# EAGLE design Osmofl2k_adapter_threechannel (EAGLE 7.5.0)
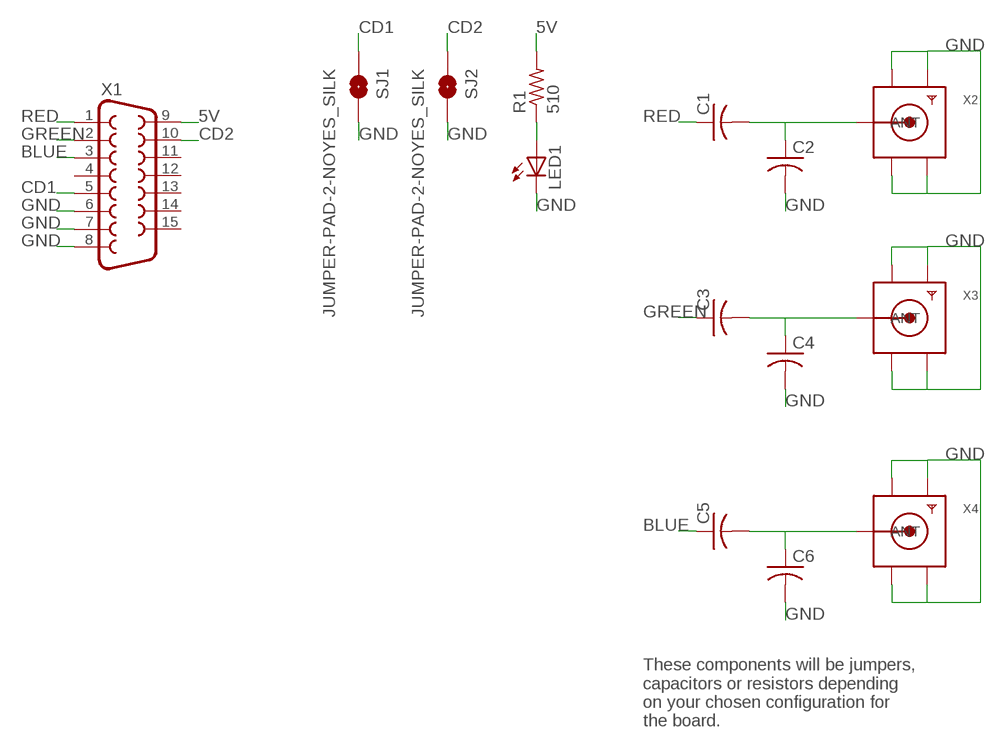
[diagram p0: schematic, sheet 1]

## Parts
C1  C-USC0603  [C0603]
C2  C-USC0603  [C0603]
C3  C-USC0603  [C0603]
C4  C-USC0603  [C0603]
C5  C-USC0603  [C0603]
C6  C-USC0603  [C0603]
LED1  LEDCHIPLED_0805  [CHIPLED_0805]
R1  510  R-US_R0805  [R0805]
SJ1  JUMPER-PAD-2-NOYES_SILK  [PAD-JUMPER-2-NO_YES_SILK]
SJ2  JUMPER-PAD-2-NOYES_SILK  [PAD-JUMPER-2-NO_YES_SILK]
X1  F15HDH  [HDF15H]
X2  SMACONNECTOR_EDGE  [SMA_EDGELAUNCH]
X3  SMACONNECTOR_EDGE  [SMA_EDGELAUNCH]
X4  SMACONNECTOR_EDGE  [SMA_EDGELAUNCH]

## Nets
5V: R1.2 X1.9
BLUE: C5.1 X1.3
CD1: SJ1.1 X1.5
CD2: SJ2.1 X1.10
GND: C2.2 C4.2 C6.2 LED1.C SJ1.2 SJ2.2 X1.6 X1.7 X1.8 X2.GND@1(GND4) X2.GND@2(GND3) X2.GND@3(GND2) X2.GND@4(GND1) X3.GND@1(GND4) X3.GND@2(GND3) X3.GND@3(GND2) X3.GND@4(GND1) X4.GND@1(GND4) X4.GND@2(GND3) X4.GND@3(GND2) X4.GND@4(GND1)
GREEN: C3.1 X1.2
N$1: C1.2 C2.1 X2.P(ANT)
N$2: LED1.A R1.1
N$3: C3.2 C4.1 X3.P(ANT)
N$4: C5.2 C6.1 X4.P(ANT)
RED: C1.1 X1.1
Unconnected: X1.4 X1.11 X1.12 X1.13 X1.14 X1.15

## Notes on the sheet
- These components will be jumpers,
  capacitors or resistors depending
  on your chosen configuration for
  the board.

## Library data of the parts
C1-C6 = adafruit:C-US: CAPACITOR, American symbol
LED1 = adafruit:LED: LED OSRAM: - CHIPLED LG R971, LG N971, LY N971, LG Q971, LY Q971, LO R971, LY R971 LH N974, LH R974 LS Q976, LO Q976, LY Q976 LO Q996 - Hyper CHIPLED LW Q18S LB Q993, LB Q99A, LB R99A - SideLED LS A670, LO A670, LY A670, LG A670, LP A670 LB A673, LV A673, LT A673, LW A673 LH A674 LY A675 LS A676, LA A676, LO A676, LY A676, LW A676 LS A679, LY A679, LG A679 - Hyper Micro SIDELED® LS Y876, LA Y876, LO Y876, LY Y876 LT Y87S - SmartLED LW L88C, LW L88S LB L89C, LB L89S, LG L890 LS L89K, LO L89K, LY L89K LS L896, LA L896, LO L896, LY L896 - TOPLED LS T670, LO T670, LY T670, LG T670, LP T670 LSG T670, LSP T670, LSY T670, LOP T670, LYG T670 LG T671, LOG T671, LSG T671 LB T673, LV T673, LT T673, LW T673 LH T674 LS T676, LA T676, LO T676, LY T676, LB T676, LH T676, LSB T676, LW T676 LB T67C, LV T67C, LT T67C, LS T67K, LO T67K, LY T67K, LW E67C LS E67B, LA E67B, LO E67B, LY E67B, LB E67C, LV E67C, LT E67C LW T67C LS T679, LY T679, LG T679 LS T770, LO T770, LY T770, LG T770, LP T770 LB T773, LV T773, LT T773, LW T773 LH T774 LS E675, LA E675, LY E675, LS T675 LS T776, LA T776, LO T776, LY T776, LB T776 LHGB T686 LT T68C, LB T68C - Hyper Mini TOPLED® LB M676 - Mini TOPLED Santana® LG M470 LS M47K, LO M47K, LY M47K Source: http://www.osram.convergy.de/
R1 = adafruit:R-US_: RESISTOR, American symbol
SJ1 SJ2 = SparkFun-Passives:JUMPER-PAD-2-NO
X1 = adafruit:F15: SUB-D HDH is also known as a 'right angle VGA' connector
X2-X4 = adafruit:SMACONNECTOR: SMA Connector 90° DIP SMA Connector, 50 Ohm (4UConnector: 07259)

## Board
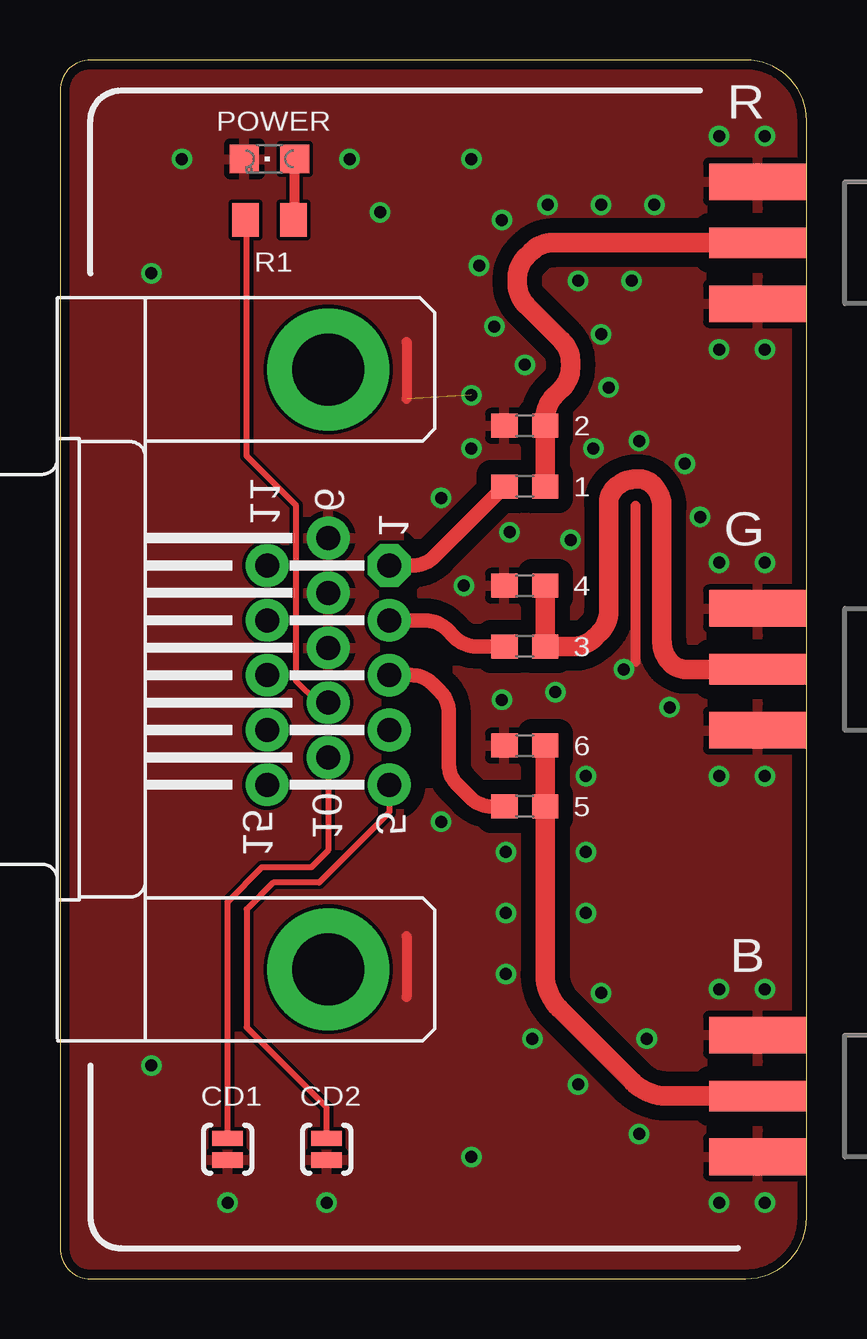
[diagram p1: board, top side]
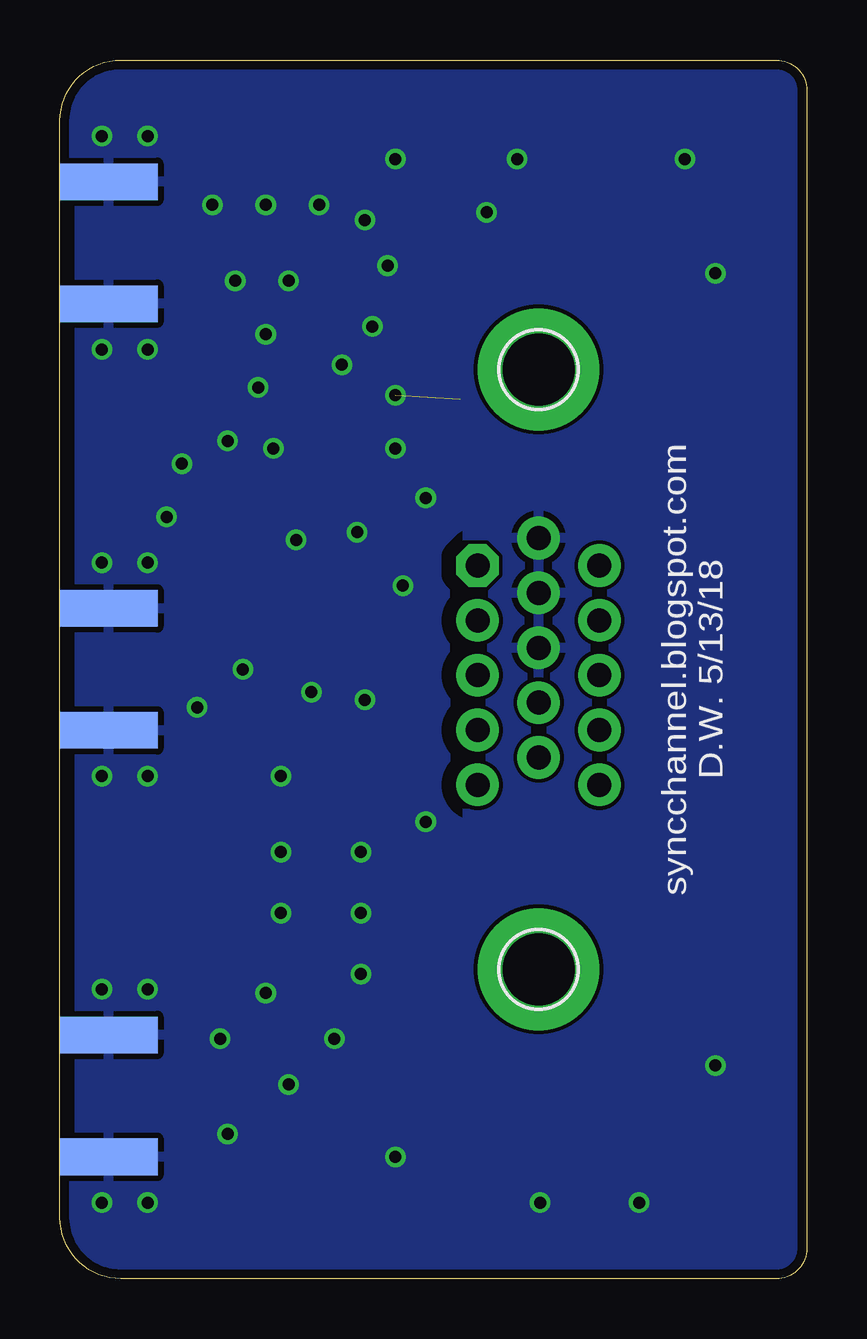
[diagram p2: board, bottom side, seen from below]

Size 31.11 x 50.8 mm. Coordinates in mm from the lower left corner, seen from the top.
Outline: 1.27,0 28.57,0 arc90 31.11,2.54 31.11,48.26 arc90 28.57,50.8 1.27,50.8 arc90 0,49.53 0,1.27 arc90 1.27,0
Copper layers (1*16): Top 0.0356mm / dielectric 1.5011mm / Bottom 0.0356mm
Design rules "LaenPCBOrder *": minimum track width 6mil, minimum drill 13mil, track to track 6mil, track to pad 6mil, pad to pad 6mil, via to via 6mil, smd to smd 6mil, copper to edge 15mil, drill to drill 6mil, minimum pad ring 7mil, minimum via ring 7mil, stop-mask expansion 3mil, vias tented up to drill 20mil, thermal gap 10mil

### Footprints (pad centres in the part's own frame; a part is rotated, then mirrored left to right if it is on the bottom)
C0603 = smd 1.1 x 1: 1 -0.85,0; 2 0.85,0
CHIPLED_0805 = smd 1.2 x 1.2: A 0,-1.05; C 0,1.05
R0805 = smd 1.1 x 1.4: 1 -1,0; 2 1,0
PAD-JUMPER-2-NO_YES_SILK = smd 0.635 x 1.27: 1 -0.45,0; 2 0.45,0
HDF15H = drill 1 pad 1.778 octagon: 1 4.329,2.54 | drill 1 pad 1.778: 2 2.043,2.54; 3 -0.243,2.54; 4 -2.529,2.54; 5 -4.815,2.54; 6 5.472,0; 7 3.186,0; 8 0.9,0; 9 -1.386,0; 10 -3.672,0; 11 4.329,-2.54; 12 2.043,-2.54; 13 -0.243,-2.54; 14 -2.529,-2.54; 15 -4.815,-2.54 | drill 3 pad 5.08: P$1 -12.5,0; P$2 12.5,0
SMA_EDGELAUNCH = smd 4.064 x 1.524: GND@1 2.032,-2.54; GND@2 2.032,2.54 | smd 4.064 x 1.524 bottom: GND@3 2.032,2.54; GND@4 2.032,-2.54 | smd 4.064 x 1.27: P 2.032,0

### Placement (x,y rotation side)
C1  19.37,33.02 0 top
C2  19.37,35.56 180 top
C3  19.37,26.35 0 top
C4  19.37,28.89 180 top
C5  19.37,19.68 0 top
C6  19.37,22.23 180 top
LED1  8.73,46.67 90 top
R1  8.73,44.13 180 top
SJ1  11.11,5.4 270 top
SJ2  6.99,5.4 270 top
X1  11.18,25.4 90 bottom
X2  31.11,43.18 180 top
X3  31.11,25.4 180 top
X4  31.11,7.62 180 top

### Tracks (layer width: path | path; a pad name or v marks a point on that pad's centre or on a via)
5V
  Top 0.254: X1.9 10.75,24.01 9.84,24.92 9.84,32.23 7.78,34.29 7.78,44.4 R1.2
BLUE
  Top 0.61: C5.1 17.99,19.68 arc-45 17.09,20.06 16.56,20.58 arc-45 16.19,21.48 16.19,23.6 arc45 15.82,24.5 15.54,24.79 arc45 14.64,25.16 X1.3
CD1
  Top 0.254: X1.5 13.72,19.43 10.79,16.51 8.89,16.51 7.78,15.4 7.78,10.48 11.11,7.14 SJ1.1
CD2
  Top 0.254: X1.10 11.18,17.84 10.48,17.14 8.41,17.14 6.99,15.72 SJ2.1
GND  (via drill 0.5)  (1 unrouted)
  Top 0.406: 14.45,39.05 14.45,36.67 | 14.45,14.29 14.45,11.75 | 23.97,32.23 23.97,25.72
  other vias: 6.99,3.17 5.08,46.67 12.06,46.67 11.11,3.17 22.54,44.77 24.13,6.03 29.37,3.17 27.46,3.17 29.37,12.06 27.46,12.06 27.46,20.95 29.37,29.84 29.37,20.95 29.37,38.73 27.46,29.84 27.46,38.73 27.46,47.62 29.37,47.62 24.77,44.77 20.32,44.77 18.41,44.13 17.46,42.23 18.1,39.69 19.37,38.1 17.14,36.83 17.14,34.61 15.88,32.54 23.81,41.59 21.59,41.59 22.54,39.37 22.23,34.61 21.27,30.8 18.73,31.11 16.83,28.89 24.13,34.92 26.04,33.97 26.67,31.75 25.4,23.81 23.5,25.4 20.64,24.45 18.41,24.13 21.91,17.78 21.91,15.24 22.54,11.91 24.45,10 21.59,8.1 19.68,10 18.57,12.7 18.57,15.24 18.57,17.78 15.88,19.05 13.34,44.45 3.81,41.91 3.81,8.89 17.14,5.08 17.14,46.67 22.86,37.15 21.91,20.95
  pour Bottom: -10.16,52.07 -10.16,-1.27 14.13,-1.27 14.13,52.07
  pour Top: -11.43,53.34 -11.43,-2.54 14.13,-2.38 14.13,53.34
  pour Bottom (isolate 0.61): 14.13,45.88 14.13,4.76 42.23,4.76 41.91,45.88
  pour Top (isolate 0.61, rank 2): 14.13,45.88 14.13,4.76 43.18,4.76 43.18,45.88
  pour Top: 14.13,45.88 14.13,53.34 43.18,53.34 43.18,45.88
  pour Bottom: 14.13,45.88 14.13,53.34 43.18,53.34 43.18,45.88
  pour Bottom: 14.13,4.76 14.13,-2.38 43.18,-2.38 43.18,4.76
  pour Top: 14.13,-2.38 14.13,4.76 43.18,4.76 43.18,-2.38
GREEN
  Top 0.61: X1.2 15.21,27.44 arc-45 16.11,27.07 16.46,26.72 arc45 17.35,26.35 C3.1
N$1
  Top 0.813: C1.2 C2.1 20.22,35.88 arc-45 20.59,36.78 20.9,37.09 arc45 21.27,37.99 21.27,38.21 arc45 20.9,39.11 19.42,40.59 arc-45 19.05,41.48 19.05,41.7 arc-45 19.42,42.6 19.63,42.81 arc-45 20.53,43.18 X2.P
N$2
  Top 0.406: R1.1 9.94,44.5 9.78,44.5 LED1.A
N$3
  Top 0.813: C4.1 C3.2 21.38,26.35 arc45 22.28,26.72 22.49,26.93 arc45 22.86,27.83 22.86,32.33 arc-45 23.12,32.97 arc-45 24.02,33.34 24.08,33.34 arc-45 24.71,33.07 arc-45 25.08,32.18 25.08,26.56 arc45 25.45,25.66 arc45 26.09,25.4 X3.P
N$4
  Top 0.813: C6.1 C5.2 20.22,12.68 arc45 20.8,11.26 23.86,8.21 arc45 25.28,7.62 X4.P
RED
  Top 0.61: X1.1 14.7,29.73 arc45 15.6,30.1 C1.1

### Text on the board
tNames: R | POWER | R1 | 2 | 1 | G | 4 | 3 | 6 | 5 | B | CD1 | CD2
bNames: syncchannel.blogspot.com / D.W. 5/13/18